# EAGLE design 27C160 to 29F800 (EAGLE 9.3.1)
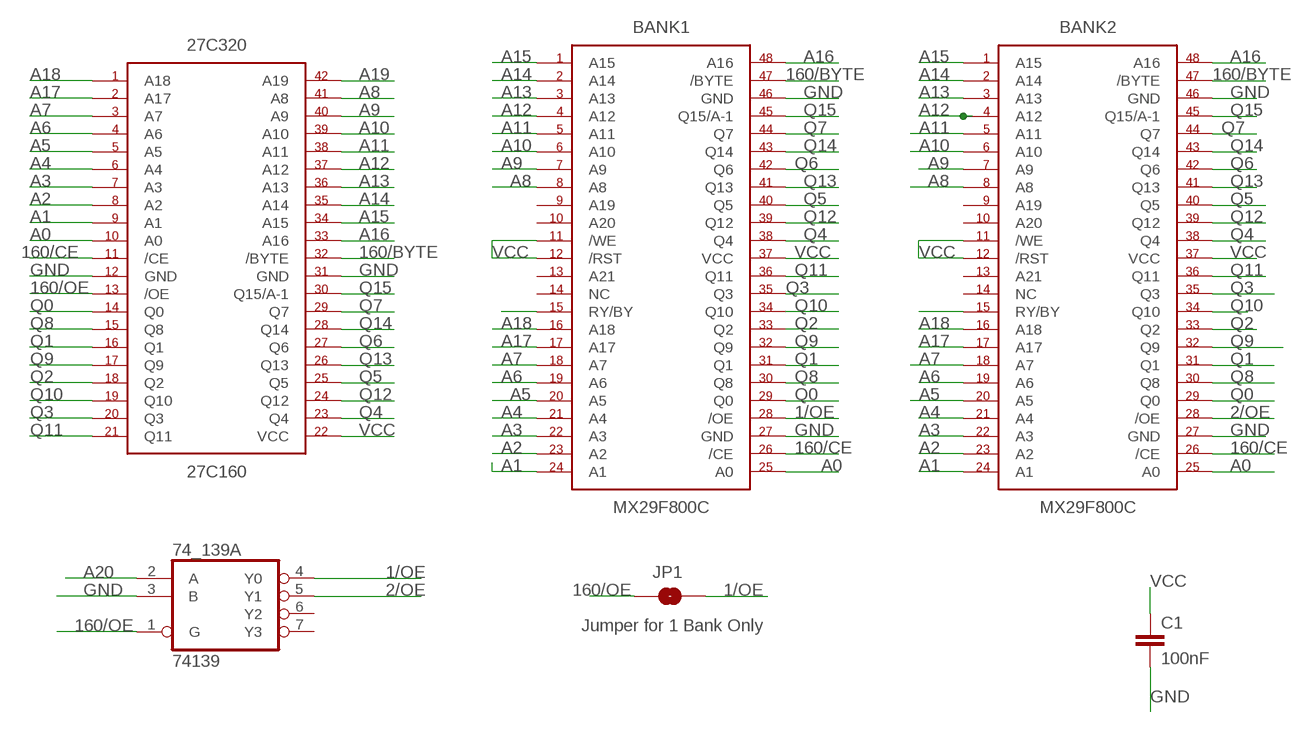
[diagram p0: schematic, sheet 1]

## Parts
27C320  27C160  [DIP_600MIL_42]
74_139  74139  [TSSOP16]
BANK1  MX29F800C  [TSOP48]
BANK2  MX29F800C  [TSOP48]
C1  100nF  10UF-0603-6.3V-20%  [0603]
JP1  JUMPER-SMT_2_NO_NO-SILK  [SMT-JUMPER_2_NO_NO-SILK]

## Nets
1/OE: 74_139.4(A:Y0) BANK1.P$28(/OE) JP1.2
2/OE: 74_139.5(A:Y1) BANK2.P$28(/OE)
160/BYTE: 27C320.P$32(/BYTE) BANK1.P$47(/BYTE) BANK2.P$47(/BYTE)
160/CE: 27C320.P$11(/CE) BANK1.P$26(/CE) BANK2.P$26(/CE)
160/OE: 27C320.P$13(/OE) 74_139.1(A:G) JP1.1
A0: 27C320.P$10(A0) BANK1.P$25(A0) BANK2.P$25(A0)
A1: 27C320.P$9(A1) BANK1.P$24(A1) BANK2.P$24(A1)
A2: 27C320.P$8(A2) BANK1.P$23(A2) BANK2.P$23(A2)
A3: 27C320.P$7(A3) BANK1.P$22(A3) BANK2.P$22(A3)
A4: 27C320.P$6(A4) BANK1.P$21(A4) BANK2.P$21(A4)
A5: 27C320.P$5(A5) BANK1.P$20(A5) BANK2.P$20(A5)
A6: 27C320.P$4(A6) BANK1.P$19(A6) BANK2.P$19(A6)
A7: 27C320.P$3(A7) BANK1.P$18(A7) BANK2.P$18(A7)
A8: 27C320.P$41(A8) BANK1.P$8(A8) BANK2.P$8(A8)
A9: 27C320.P$40(A9) BANK1.P$7(A9) BANK2.P$7(A9)
A10: 27C320.P$39(A10) BANK1.P$6(A10) BANK2.P$6(A10)
A11: 27C320.P$38(A11) BANK1.P$5(A11) BANK2.P$5(A11)
A12: 27C320.P$37(A12) BANK1.P$4(A12) BANK2.P$4(A12)
A13: 27C320.P$36(A13) BANK1.P$3(A13) BANK2.P$3(A13)
A14: 27C320.P$35(A14) BANK1.P$2(A14) BANK2.P$2(A14)
A15: 27C320.P$34(A15) BANK1.P$1(A15) BANK2.P$1(A15)
A16: 27C320.P$33(A16) BANK1.P$48(A16) BANK2.P$48(A16)
A17: 27C320.P$2(A17) BANK1.P$17(A17) BANK2.P$17(A17)
A18: 27C320.P$1(A18) BANK1.P$16(A18) BANK2.P$16(A18)
A19: 27C320.P$42(A19)
A20: 74_139.2(A:A)
GND: 27C320.P$12(GND) 27C320.P$31(GND) 74_139.3(A:B) BANK1.P$27(GND) BANK1.P$46(GND) BANK2.P$27(GND) BANK2.P$46(GND) C1.2
N$11: BANK1.P$11(/WE)
N$14: BANK1.P$15(RY/BY)
N$17: BANK2.P$15(RY/BY)
Q0: 27C320.P$14(Q0) BANK1.P$29(Q0) BANK2.P$29(Q0)
Q1: 27C320.P$16(Q1) BANK1.P$31(Q1) BANK2.P$31(Q1)
Q2: 27C320.P$18(Q2) BANK1.P$33(Q2) BANK2.P$33(Q2)
Q3: 27C320.P$20(Q3) BANK1.P$35(Q3) BANK2.P$35(Q3)
Q4: 27C320.P$23(Q4) BANK1.P$38(Q4) BANK2.P$38(Q4)
Q5: 27C320.P$25(Q5) BANK1.P$40(Q5) BANK2.P$40(Q5)
Q6: 27C320.P$27(Q6) BANK1.P$42(Q6) BANK2.P$42(Q6)
Q7: 27C320.P$29(Q7) BANK1.P$44(Q7) BANK2.P$44(Q7)
Q8: 27C320.P$15(Q8) BANK1.P$30(Q8) BANK2.P$30(Q8)
Q9: 27C320.P$17(Q9) BANK1.P$32(Q9) BANK2.P$32(Q9)
Q10: 27C320.P$19(Q10) BANK1.P$34(Q10) BANK2.P$34(Q10)
Q11: 27C320.P$21(Q11) BANK1.P$36(Q11) BANK2.P$36(Q11)
Q12: 27C320.P$24(Q12) BANK1.P$39(Q12) BANK2.P$39(Q12)
Q13: 27C320.P$26(Q13) BANK1.P$41(Q13) BANK2.P$41(Q13)
Q14: 27C320.P$28(Q14) BANK1.P$43(Q14) BANK2.P$43(Q14)
Q15: 27C320.P$30(Q15/A-1) BANK1.P$45(Q15/A-1) BANK2.P$45(Q15/A-1)
VCC: 27C320.P$22(VCC) BANK1.P$12(/RST) BANK1.P$37(VCC) BANK2.P$11(/WE) BANK2.P$12(/RST) BANK2.P$37(VCC) C1.1
Unconnected: 74_139.6(A:Y2) 74_139.7(A:Y3) 74_139.9(B:Y3) 74_139.10(B:Y2) 74_139.11(B:Y1) 74_139.12(B:Y0) 74_139.13(B:G) 74_139.14(B:B) 74_139.15(B:A) BANK1.P$9(A19) BANK1.P$10(A20) BANK1.P$13(A21) BANK1.P$14(NC) BANK2.P$9(A19) BANK2.P$10(A20) BANK2.P$13(A21) BANK2.P$14(NC)

## Notes on the sheet
- Jumper for 1 Bank Only

## Power pins joined to a net without a drawn wire
GND: 74_139.8(P:GND)
VCC: 74_139.16(P:VCC)

## Library data of the parts
27C320 = GEN-CART-BASIC:27C160
74_139 = snes maskrom:74*139: Dual 2-line to 4-line DECODER/DEMULTIPLEXER
BANK1 BANK2 = GEN-CART-BASIC:MX29F800C
C1 = SparkFun-Capacitors:10UF: 10.0µF ceramic capacitors A capacitor is a passive two-terminal electrical component used to store electrical energy temporarily in an electric field.; PROD_ID: CAP-11015; VALUE: 10uF
JP1 = SparkFun-Jumpers:JUMPER-SMT_2_NO: Normally open jumper This jumper has two pads in close proximity to each other. Apply solder to close the connection. Round pads are easier to solder for beginners, but are a lot larger. SparkFun Product that uses the round pads: SparkFun EL Sequencer <https://www.sparkfun.com/products/12781>

## Board
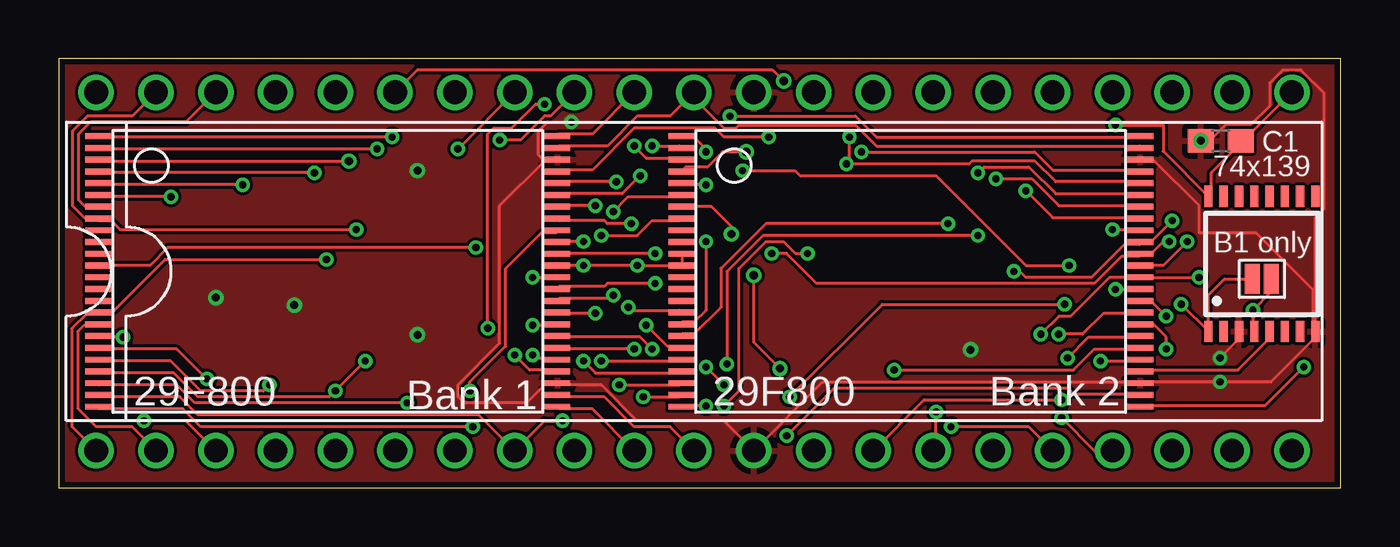
[diagram p1: board, top side]
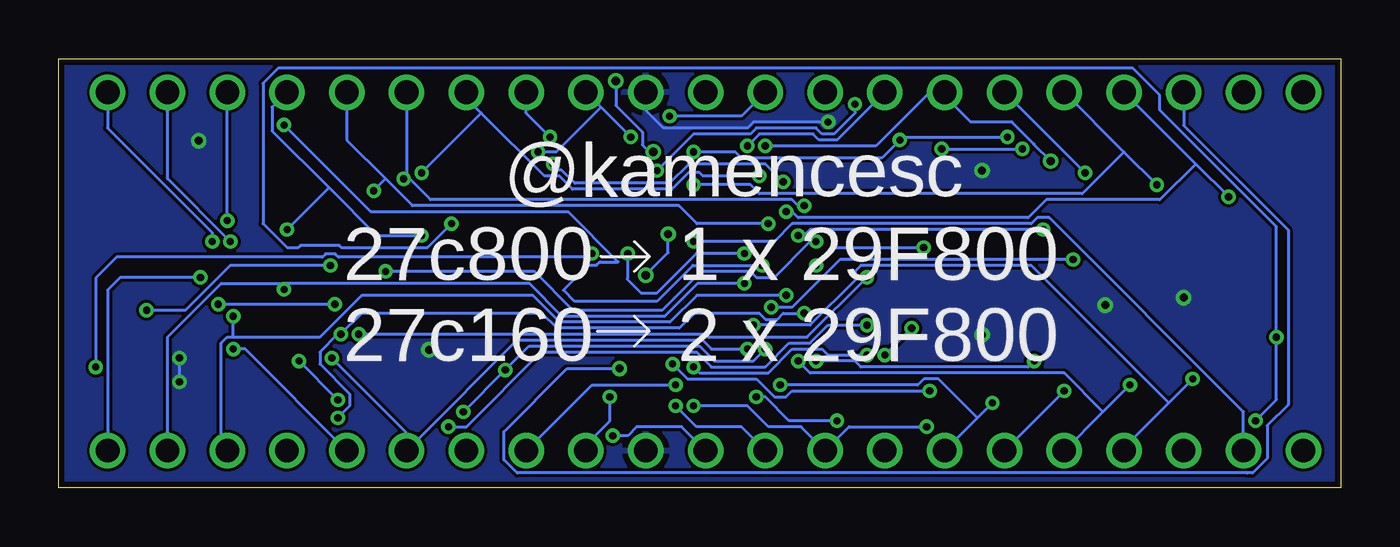
[diagram p2: board, bottom side, seen from below]

Size 54.46 x 18.25 mm. Coordinates in mm from the lower left corner, seen from the top.
Outline: 0,0 54.46,0 54.46,18.25 0,18.25 0,0
Copper layers (1*16): Top 0.035mm / dielectric 1.5mm / Bottom 0.035mm
Design rules "dirtypcbs_2_layer": minimum track width 5mil, minimum drill 12mil, track to track 5mil, track to pad 5mil, pad to pad 5mil, via to via 5mil, smd to smd 0mil, copper to edge 10mil, drill to drill 10mil, minimum pad ring 10mil, minimum via ring 6mil, stop-mask expansion 2mil, vias tented up to drill 25mil, thermal gap 10mil

### Footprints (pad centres in the part's own frame; a part is rotated, then mirrored left to right if it is on the bottom)
DIP_600MIL_42 = drill 1: P$1 -25.4,-7.62; P$2 -22.86,-7.62; P$3 -20.32,-7.62; P$4 -17.78,-7.62; P$5 -15.24,-7.62; P$6 -12.7,-7.62; P$7 -10.16,-7.62; P$8 -7.62,-7.62; P$9 -5.08,-7.62; P$10 -2.54,-7.62; P$11 0,-7.62; P$12 2.54,-7.62; P$13 5.08,-7.62; P$14 7.62,-7.62; P$15 10.16,-7.62; P$16 12.7,-7.62; P$17 15.24,-7.62; P$18 17.78,-7.62; P$19 20.32,-7.62; P$20 22.86,-7.62; P$21 25.4,-7.62; P$22 25.4,7.62; P$23 22.86,7.62; P$24 20.32,7.62; P$25 17.78,7.62; P$26 15.24,7.62; P$27 12.7,7.62; P$28 10.16,7.62; P$29 7.62,7.62; P$30 5.08,7.62; P$31 2.54,7.62; P$32 0,7.62; P$33 -2.54,7.62; P$34 -5.08,7.62; P$35 -7.62,7.62; P$36 -10.16,7.62; P$37 -12.7,7.62; P$38 -15.24,7.62; P$39 -17.78,7.62; P$40 -20.32,7.62; P$41 -22.86,7.62; P$42 -25.4,7.62
TSSOP16 = smd 0.9 x 0.35: 1 -2.875,2.275; 2 -2.875,1.625; 3 -2.875,0.975; 4 -2.875,0.325; 5 -2.875,-0.325; 6 -2.875,-0.975; 7 -2.875,-1.625; 8 -2.875,-2.275; 9 2.875,-2.275; 10 2.875,-1.625; 11 2.875,-0.975; 12 2.875,-0.325; 13 2.875,0.325; 14 2.875,0.975; 15 2.875,1.625; 16 2.875,2.275
TSOP48 = smd 1.1 x 0.25: P$1 -9.75,5.75; P$2 -9.75,5.25; P$3 -9.75,4.75; P$4 -9.75,4.25; P$5 -9.75,3.75; P$6 -9.75,3.25; P$7 -9.75,2.75; P$8 -9.75,2.25; P$9 -9.75,1.75; P$10 -9.75,1.25; P$11 -9.75,0.75; P$12 -9.75,0.25; P$13 -9.75,-0.25; P$14 -9.75,-0.75; P$15 -9.75,-1.25; P$16 -9.75,-1.75; P$17 -9.75,-2.25; P$18 -9.75,-2.75; P$19 -9.75,-3.25; P$20 -9.75,-3.75; P$21 -9.75,-4.25; P$22 -9.75,-4.75; P$23 -9.75,-5.25; P$24 -9.75,-5.75; P$25 9.75,-5.75; P$26 9.75,-5.25; P$27 9.75,-4.75; P$28 9.75,-4.25; P$29 9.75,-3.75; P$30 9.75,-3.25; P$31 9.75,-2.75; P$32 9.75,-2.25; P$33 9.75,-1.75; P$34 9.75,-1.25; P$35 9.75,-0.75; P$36 9.75,-0.25; P$37 9.75,0.25; P$38 9.75,0.75; P$39 9.75,1.25; P$40 9.75,1.75; P$41 9.75,2.25; P$42 9.75,2.75; P$43 9.75,3.25; P$44 9.75,3.75; P$45 9.75,4.25; P$46 9.75,4.75; P$47 9.75,5.25; P$48 9.75,5.75
0603 = smd 1.1 x 1: 1 -0.85,0; 2 0.85,0
SMT-JUMPER_2_NO_NO-SILK = smd 0.635 x 1.27: 1 -0.406,0; 2 0.406,0

### Placement (x,y rotation side)
27C320  26.99,9.21 0 top
74_139  51.12,9.52 90 top
BANK1  11.43,9.21 0 top
BANK2  36.2,9.21 0 top
C1  49.37,14.76 180 top
JP1  51.12,8.89 0 top

### Tracks (layer width: path | path; a pad name or v marks a point on that pad's centre or on a via)
1/OE  (via drill 0.3)
  Top 0.127: v42.93,9.46 41.08,9.46 37.27,13.27 31.5,13.27 31.27,13.49 v29.05,13.49 | v20.64,16.32 20.26,16.32 19.24,15.3 18.48,15.3 18.22,15.05 v18.22,6.79 | v19.37,5.65 20,5.02 21.15,5.02 BANK1.P$28 | 74_139.4 50.74,6.67 v50.74,7.56 51.52,8.34 JP1.2
  Bottom 0.127: v50.74,7.56 49.09,7.56 47.18,9.46 v42.93,9.46 | v29.05,13.49 27.5,15.05 25.08,15.05 24.83,15.3 22.29,15.3 22.03,15.05 21.53,15.05 20.64,15.94 v20.64,16.32 | v19.37,5.65 v18.22,6.79
2/OE
  Top 0.127: 74_139.5 51.37,6.54 51.37,6.29 50.1,5.02 46.04,5.02 BANK2.P$28
160/BYTE
  Top 0.127: 26.86,16.7 25.97,15.81 24.57,15.81 23.3,14.54 21.27,14.54 BANK1.P$47 | 26.86,16.7 28.26,15.3 28.77,15.3 28.89,15.43 33.85,15.43 34.73,14.54 45.91,14.54 BANK2.P$47 | 26.86,16.7 27C320.P$32
160/CE  (via drill 0.3)
  Top 0.127: 27C320.P$11 25.97,2.6 24.45,2.6 23.18,3.87 21.27,3.87 BANK1.P$26 | v30.92,2.22 32.96,4.25 42.86,4.25 43.12,4 45.91,4 BANK2.P$26
  Bottom 0.127: v30.92,2.22 30.29,2.22 29.91,2.6 28,2.6 27C320.P$11
160/OE  (via drill 0.3)
  Top 0.127: v47.69,7.81 48.83,6.67 74_139.1 48.84,8.2 49.53,8.89 JP1.1 | v42.74,7.81 34.99,7.81 v31.05,3.87
  Bottom 0.127: v42.74,7.81 v47.69,7.81 | v31.05,3.87 31.05,2.86 32.07,1.84 27C320.P$13
A0  (via drill 0.3)
  Top 0.127: 27C320.P$10 22.67,3.37 21.27,3.37 BANK1.P$25 | v52.9,5.14 51.24,3.49 46.04,3.49 BANK2.P$25 | v31.81,9.97 31.31,9.97 30.8,10.48 30.04,10.48 28.89,9.33 28.89,4.13 v28.26,3.49
  Bottom 0.127: v52.9,5.14 52.9,8.92 52.01,9.81 43.28,9.81 43.13,9.96 42.72,9.96 42.57,9.81 31.97,9.81 v31.81,9.97 | v28.26,3.49 27.37,2.6 25.46,2.6 27C320.P$10
A1  (via drill 0.3)
  Top 0.127: v17.59,2.6 6.03,2.6 5.27,3.37 1.71,3.37 BANK1.P$24 | v27.5,3.49 26.48,3.49 BANK2.P$24
  Bottom 0.127: v17.59,2.6 20.89,2.6 27C320.P$9 22.92,2.6 24.32,2.6 25.21,3.49 v27.5,3.49
A2  (via drill 0.3)
  Top 0.127: BANK1.P$23 1.71,3.87 5.14,3.87 5.91,3.11 17.84,3.11 27C320.P$8 20.64,2.86 v21.4,2.86 | v24.83,3.87 26.35,3.87 BANK2.P$23
  Bottom 0.127: v24.83,3.87 24.45,3.87 23.43,2.86 v21.4,2.86
A3  (via drill 0.3)
  Top 0.127: v14.8,3.62 5.78,3.62 5.02,4.38 1.71,4.38 BANK1.P$22 | v23.81,4.38 26.35,4.38 BANK2.P$22
  Bottom 0.127: 27C320.P$7 15.43,2.98 | 15.43,2.98 v14.8,3.62 | v23.81,4.38 17.97,4.38 17.72,4.64 17.08,4.64 15.43,2.98
A4  (via drill 0.3)
  Top 0.127: BANK1.P$21 1.71,4.89 4.89,4.89 5.91,3.87 11.49,3.87 v11.75,4.13 v13.02,5.4 | v22.29,5.4 22.8,4.89 26.35,4.89 BANK2.P$21
  Bottom 0.127: 27C320.P$6 v11.75,4.13 | v22.29,5.4 20.64,5.4 20.38,5.14 13.27,5.14 v13.02,5.4
A5  (via drill 0.3)
  Top 0.127: v8.95,4.38 8.7,4.13 6.03,4.13 4.76,5.4 1.71,5.4 BANK1.P$20 | v23.05,5.4 26.35,5.4 BANK2.P$20
  Bottom 0.127: 27C320.P$5 10.1,3.24 | 10.1,3.24 v8.95,4.38 | v23.05,5.4 22.54,4.89 11.75,4.89 10.1,3.24
A6  (via drill 0.3)
  Top 0.127: v6.29,4.64 5.02,5.91 1.71,5.91 BANK1.P$19 | v24.96,6.92 25.84,6.03 26.35,6.03 BANK2.P$19
  Bottom 0.127: 7.3,3.62 9.21,1.71 27C320.P$4 | 7.3,3.62 v6.29,4.64 | v24.96,6.92 22.54,6.92 20.64,8.83 20.64,9.21 20.38,9.46 13.14,9.46 7.3,3.62
A7  (via drill 0.3)
  Top 0.127: v2.73,6.41 1.71,6.41 BANK1.P$18 | v3.62,2.86 5.4,2.86 27C320.P$3 | v37.78,11.24 30.04,11.24 28.13,9.33 28.13,7.68 26.99,6.54 26.48,6.54 BANK2.P$18
  Bottom 0.127: v3.62,2.86 2.73,3.75 v2.73,6.41 2.73,11.11 7.68,16.07 7.68,16.7 8.83,17.84 45.15,17.84 45.78,17.21 45.78,11.24 44.77,10.22 44.29,10.22 44.2,10.32 42.55,10.32 42.45,10.22 38.8,10.22 v37.78,11.24
A8  (via drill 0.3)
  Top 0.127: 27C320.P$41 3.11,15.81 1.21,15.81 0.57,15.18 0.57,12 1.08,11.49 1.59,11.49 BANK1.P$8 1.71,11.37 2.22,11.37 2.6,10.99 v12.64,10.99 | v23.05,10.73 24.57,10.73 25.21,11.37 26.35,11.37 BANK2.P$8
  Bottom 0.127: v23.05,10.73 22.8,10.73 22.54,10.99 v12.64,10.99
A9  (via drill 0.35)
  Top 0.127: 27C320.P$40 5.4,15.56 1.33,15.56 0.83,15.05 0.83,12.26 1.08,12 1.59,12 BANK1.P$7 | v30.64,5.08 29.53,6.19 v29.53,9.05 | v28.57,10.8 28.57,11.11 27.73,11.96 BANK2.P$7
  Bottom 0.127: v30.64,5.08 32.86,5.08 35.55,2.39 35.55,1.2 34.99,0.63 3.97,0.63 3.96,0.64 3.74,0.64 3.12,1.26 3.12,2.65 2.24,3.54 2.24,10.98 6.67,15.41 27C320.P$40 | v29.53,9.05 28.57,10 v28.57,10.8
A10  (via drill 0.3)
  Top 0.127: v4.76,12.38 1.71,12.38 BANK1.P$6 | v23.56,11.75 24.19,12.38 26.35,12.38 BANK2.P$6
  Bottom 0.127: 27C320.P$39 6.16,13.78 | 6.16,13.78 v4.76,12.38 | v23.56,11.75 23.3,11.75 23.05,11.49 13.27,11.49 12.51,12.26 7.68,12.26 6.16,13.78
A11  (via drill 0.3)
  Top 0.127: v7.81,12.89 1.71,12.89 BANK1.P$5 | v27.5,12.89 26.48,12.89 BANK2.P$5
  Bottom 0.127: 27C320.P$38 9.21,14.29 | 9.21,14.29 v7.81,12.89 | v27.5,12.89 25.08,12.89 24.7,12.51 10.99,12.51 9.21,14.29
A12  (via drill 0.3, 0.35)
  Top 0.127: v10.86,13.4 1.71,13.4 BANK1.P$4 | 27C320.P$37 15.24,17.78 30.32,17.78 v30.8,17.3 | BANK2.P$4 26.63,13.64 27.55,13.64 28.2,14.29 v29.21,14.29
  Bottom 0.127: 27C320.P$37 v10.86,13.4 | v30.8,17.3 30.8,16.26 29.67,15.13 29.67,14.59 29.37,14.29 v29.21,14.29
A13  (via drill 0.3, 0.35)
  Top 0.127: BANK1.P$3 1.71,13.91 v12.32,13.91 v12.32,13.9 | v24.45,14.54 24.96,14.03 26.35,14.03 BANK2.P$3
  Bottom 0.127: v24.45,14.54 19.75,14.54 17.46,16.83 27C320.P$36 16.83,16.67 15.72,15.56 13.97,15.56 13.03,14.62 13.03,14.61 v12.32,13.9
A14  (via drill 0.3)
  Top 0.127: v13.53,14.41 1.71,14.41 BANK1.P$2 | 27C320.P$35 v16.95,14.41 | v25.21,14.54 26.35,14.54 BANK2.P$2
  Bottom 0.127: v16.95,14.41 v13.53,14.41 | v25.21,14.54 24.7,15.05 22.42,15.05 22.16,14.8 21.4,14.8 27C320.P$35
A15  (via drill 0.3)
  Top 0.127: v14.16,14.92 1.71,14.92 BANK1.P$1 | v18.73,14.8 19.62,14.8 20.64,15.81 20.89,15.81 27C320.P$34 | v27.5,14.29 27.5,14.41 26.99,14.92 26.48,14.92 BANK2.P$1
  Bottom 0.127: v14.16,14.92 18.61,14.92 v18.73,14.8 19.49,14.03 25.46,14.03 25.72,14.29 v27.5,14.29
A16  (via drill 0.3)
  Top 0.127: 27C320.P$33 22.67,15.05 21.27,15.05 BANK1.P$48 | v28.51,15.81 33.85,15.81 34.73,14.92 45.91,14.92 BANK2.P$48
  Bottom 0.127: v28.51,15.81 25.46,15.81 27C320.P$33
A17  (via drill 0.3)
  Top 0.127: 27C320.P$2 3.11,2.6 1.59,2.6 0.83,3.37 0.83,6.67 1.08,6.92 1.59,6.92 BANK1.P$17 | v27.5,10.48 27.5,7.56 26.99,7.05 26.48,7.05 BANK2.P$17
  Bottom 0.127: v27.5,10.48 24.07,10.48 23.3,11.24 13.14,11.24 12.89,11.49 12.38,11.49 4.13,3.24 27C320.P$2
A18  (via drill 0.3)
  Top 0.127: 27C320.P$1 0.57,2.6 0.57,6.79 1.21,7.43 1.59,7.43 BANK1.P$16 1.71,7.56 2.35,7.56 4.51,9.72 v11.37,9.72 | v24.19,7.68 24.32,7.56 26.35,7.56 BANK2.P$16
  Bottom 0.127: v24.19,7.68 23.3,7.68 21.27,9.72 v11.37,9.72
GND  (via drill 0.3, 0.35)
  Top 0.127: 53.28,7.05 53.28,6.67 74_139.8 | 74_139.8 53.28,6.54 53.28,6.29 51.5,4.51 v49.34,4.51 46.04,4.51 BANK2.P$27 45.91,4.51 32.45,4.51 27C320.P$12 28.26,2.86 24.57,2.86 23.05,4.38 21.27,4.38 BANK1.P$27 21.15,4.38 20.64,4.38 19.88,3.62 17.21,3.62 16.95,3.87 16.95,4.38 18.73,6.16 18.73,12 20.64,13.91 | BANK2.P$46 46.04,13.91 46.55,13.91 48.45,12 48.45,10.86 50.86,10.86 53.28,8.45 53.28,7.05 | 20.64,13.91 21.15,13.91 BANK1.P$46 20.64,13.91 | v21.78,15.56 20.76,15.56 20.38,15.18 20.38,14.16 20.64,13.91 | v49.34,5.52 50.1,6.29 50.1,6.54 74_139.3 | 53.28,7.05 74_139.8 | C1.2 48.9,14.76 49.59,15.45 50.66,15.45 51.44,16.24 51.44,17.22 52,17.77 52.78,17.77 53.76,16.79 53.76,11.87 53.39,11.51 74_139.8
  Bottom 0.127: 27C320.P$31 29.53,16.07 28.77,15.3 25.21,15.3 24.96,15.56 v21.78,15.56 | v49.34,4.51 v49.34,5.52
  other vias: 6.67,8.1 48.52,14.76 10,7.78 15.24,6.51 15.24,13.49 38.73,5.87
  pour Top: -0.16,18.41 54.77,18.41 54.77,-0.64 -0.16,-0.64
  pour Bottom: -0.48,18.73 55.24,18.73 55.24,-1.27 -0.48,-1.27
Q0  (via drill 0.3)
  Top 0.127: v20.13,5.65 20.26,5.52 21.15,5.52 BANK1.P$29 | v28.26,4.38 v27.5,5.14 | v44.26,5.4 45.91,5.4 BANK2.P$29 | v42.61,3.75 36.77,3.75 27C320.P$14
  Bottom 0.127: v20.13,5.65 21.78,5.65 22.03,5.91 23.3,5.91 24.32,4.89 27.24,4.89 v27.5,5.14 | v28.26,4.38 31.81,4.38 27C320.P$14 | v42.61,3.75 v44.26,5.4
Q1  (via drill 0.3)
  Top 0.127: v25.21,5.91 24.7,6.41 21.27,6.41 BANK1.P$31 | v42.86,5.52 43.75,6.41 45.91,6.41 BANK2.P$31
  Bottom 0.127: v25.21,5.91 26.73,5.91 27.11,6.29 34.99,6.29 39.31,1.97 | 39.31,1.97 v42.86,5.52 | 39.31,1.97 27C320.P$16
Q2  (via drill 0.3)
  Top 0.127: v22.8,7.43 21.27,7.43 BANK1.P$33 | v42.48,6.54 43.5,6.54 44.39,7.43 45.91,7.43 BANK2.P$33 | 27C320.P$18 44.01,1.59 v42.61,2.98
  Bottom 0.127: v22.8,7.43 23.69,7.43 23.94,7.18 24.45,7.18 24.7,7.43 27.46,7.43 28.1,6.79 33.29,6.79 33.92,7.43 41.59,7.43 v42.48,6.54 42.61,6.54 43.37,5.78 43.37,5.27 42.1,4 42.1,3.49 v42.61,2.98
Q3  (via drill 0.3)
  Top 0.127: v25.34,8.7 23.3,8.7 23.18,8.57 21.27,8.57 BANK1.P$35 | v44.89,8.45 45.91,8.45 BANK2.P$35
  Bottom 0.127: 44.89,8.7 47.56,8.7 49.85,6.41 27C320.P$20 | 44.89,8.7 v44.89,8.45 | v25.34,8.7 27.32,8.7 28.72,7.3 33.08,7.3 34.47,8.7 44.89,8.7
Q4  (via drill 0.3)
  Top 0.127: v25.34,9.97 21.27,9.97 BANK1.P$38 | v30.29,9.97 30.92,9.97 32.19,8.7 44.01,8.7 45.15,9.84 45.91,9.84 BANK2.P$38 46.04,9.97 46.42,9.97 46.93,10.48 v47.18,10.48
  Bottom 0.127: 27C320.P$23 49.85,13.14 v47.18,10.48 | v30.29,9.97 30.29,8.92 30.32,8.89 29.71,8.28 29.07,8.28 27.38,9.97 v25.34,9.97
Q5  (via drill 0.3)
  Top 0.127: v17.46,4.13 17.46,4.51 18.99,6.03 18.99,9.33 20.51,10.86 21.15,10.86 BANK1.P$40 | v28.38,5.27 28.38,9.21 29.91,10.73 v39.05,10.73 | v44.77,10.99 45.91,10.99 BANK2.P$40
  Bottom 0.127: v17.46,4.13 23.3,4.13 23.56,3.87 24.07,3.87 24.83,4.64 27.75,4.64 v28.38,5.27 | v39.05,10.73 40.96,10.73 42.99,12.76 | 42.99,12.76 45.4,15.18 45.4,16.19 27C320.P$25 | 42.99,12.76 v44.77,10.99
Q6  (via drill 0.3)
  Top 0.127: v22.8,12 21.27,12 BANK1.P$42 | v39.81,13.14 41.34,13.14 42.48,12 45.91,12 BANK2.P$42
  Bottom 0.127: v22.8,12 23.05,12 23.3,12.26 38.67,12.26 39.69,13.27 | 27C320.P$27 39.69,13.27 | 39.69,13.27 v39.81,13.14
Q7  (via drill 0.3)
  Top 0.127: v23.69,13.02 21.27,13.02 BANK1.P$44 | 33.59,13.78 38.67,13.78 38.8,13.91 41.47,13.91 42.35,13.02 45.91,13.02 BANK2.P$44 | 33.59,13.78 v33.59,14.92 | 33.59,13.78 v33.46,13.78
  Bottom 0.127: v23.69,13.02 24.45,13.78 27.7,13.78 28.52,12.95 32.53,12.95 33.11,13.53 33.21,13.53 v33.46,13.78 | 27C320.P$29 34.61,15.94 v33.59,14.92
Q8  (via drill 0.3)
  Top 0.127: v24.45,5.91 21.27,5.91 BANK1.P$30 | v37.27,3.24 37.27,1.71 27C320.P$15 | v35.5,5.02 43.12,5.02 44.01,5.91 45.91,5.91 BANK2.P$30
  Bottom 0.127: v24.45,5.91 24.96,5.4 26.61,5.4 27.24,6.03 34.48,6.03 v35.5,5.02 v37.27,3.24
Q9  (via drill 0.3)
  Top 0.127: v20.13,6.92 21.15,6.92 BANK1.P$32 | v37.91,2.6 41.21,2.6 27C320.P$17 | v47.05,5.91 47.05,6.41 46.55,6.92 46.04,6.92 BANK2.P$32
  Bottom 0.127: v20.13,6.92 21.78,6.92 22.54,6.16 23.43,6.16 24.45,5.14 26.73,5.14 27.37,5.78 33.97,5.78 37.15,2.6 v37.91,2.6 | v47.05,5.91 46.55,5.91 27C320.P$17
Q10  (via drill 0.3)
  Top 0.127: v23.56,8.19 23.43,8.06 21.27,8.06 BANK1.P$34 | v47.05,7.3 46.42,7.94 46.04,7.94 BANK2.P$34
  Bottom 0.127: 47.05,6.41 47.31,6.41 47.56,6.16 47.56,1.84 27C320.P$19 | 47.05,6.41 43.37,6.41 41.59,8.19 34.32,8.19 33.18,7.05 28.5,7.05 27.36,8.19 v23.56,8.19 | 47.05,6.41 v47.05,7.3
Q11  (via drill 0.3)
  Top 0.127: v20.13,8.95 21.15,8.95 BANK1.P$36 | v41.72,6.54 42.48,7.3 42.99,7.3 44.64,8.95 45.91,8.95 BANK2.P$36 46.04,8.95 v48.45,8.95
  Bottom 0.127: v20.13,8.95 22.67,6.41 26.86,6.41 26.99,6.54 v41.72,6.54 | 27C320.P$21 52.39,8.41 51.85,8.95 v48.45,8.95
Q12  (via drill 0.3)
  Top 0.127: v22.29,10.48 21.27,10.48 BANK1.P$39 | v40.58,9.21 40.83,9.21 41.08,8.95 43.88,8.95 45.28,10.35 45.91,10.35 BANK2.P$39 46.04,10.48 46.42,10.48 v47.31,11.37
  Bottom 0.127: v22.29,10.48 22.54,10.48 24.07,8.95 24.83,8.95 25.08,9.21 27.18,9.21 28.83,7.56 32.61,7.56 34.26,9.21 v40.58,9.21 | v47.31,11.37 27C320.P$24
Q13  (via drill 0.3)
  Top 0.127: v24.32,11.24 23.3,11.24 23.18,11.37 21.27,11.37 BANK1.P$41 | v41.08,12.64 42.23,11.49 45.91,11.49 BANK2.P$41
  Bottom 0.127: 40.58,13.14 42.23,14.8 27C320.P$26 | 40.58,13.14 39.43,12 28.11,12 27.35,11.24 v24.32,11.24 | 40.58,13.14 v41.08,12.64
Q14  (via drill 0.3)
  Top 0.127: v24.7,13.27 23.94,12.51 21.27,12.51 BANK1.P$43 | v39.05,13.4 39.31,13.65 41.21,13.65 42.35,12.51 45.91,12.51 BANK2.P$43
  Bottom 0.127: v24.7,13.27 27.11,13.27 27.24,13.4 27.72,13.4 28.42,12.7 32.64,12.7 33.21,13.27 33.85,13.27 36.51,15.94 | 36.51,15.94 37.15,16.57 27C320.P$28 | 36.51,15.94 v39.05,13.4
Q15  (via drill 0.3)
  Top 0.127: v30.16,14.92 28.26,14.92 27.88,15.3 24.45,15.3 22.67,13.53 21.27,13.53 BANK1.P$45 | v34.1,14.29 41.47,14.29 42.23,13.53 45.91,13.53 BANK2.P$45
  Bottom 0.127: 27C320.P$30 31.43,16.19 | 31.43,16.19 v30.16,14.92 | v34.1,14.29 33.34,14.29 31.43,16.19
VCC  (via drill 0.3)
  Top 0.127: v44.89,15.43 46.93,15.43 46.93,14.32 74_139.16 48.96,12.51 48.96,13.4 50.22,14.66 C1.1 50.32,14.76 27C320.P$22 | BANK1.P$37 21.27,9.46 v22.29,9.46 v24.57,9.46 26.35,9.46 BANK2.P$12 26.48,9.46 26.48,9.84 BANK2.P$11 | v47.94,10.48 46.93,9.46 46.04,9.46 BANK2.P$37 | v17.72,10.22 4.64,10.22 3.87,9.46 1.71,9.46 BANK1.P$12
  Bottom 0.127: v44.89,15.43 41.21,11.75 32.83,11.75 30.7,9.61 31.47,9.61 31.61,9.47 31.96,9.47 33.02,8.41 32.54,7.94 29.05,7.94 27.53,9.46 v24.57,9.46 | v47.94,10.48 47.94,10.86 52.39,15.3 27C320.P$22 | v17.72,10.22 21.53,10.22 v22.29,9.46

### Text on the board
tNames: C1 | 74x139 | B1 only | 29F800 | Bank 1 | 29F800 | Bank 2
bNames: @kamencesc | 27c800 1 x 29F800 / 27c160 2 x 29F800